# Altium schematic sheet Payload.SchDoc
size A4
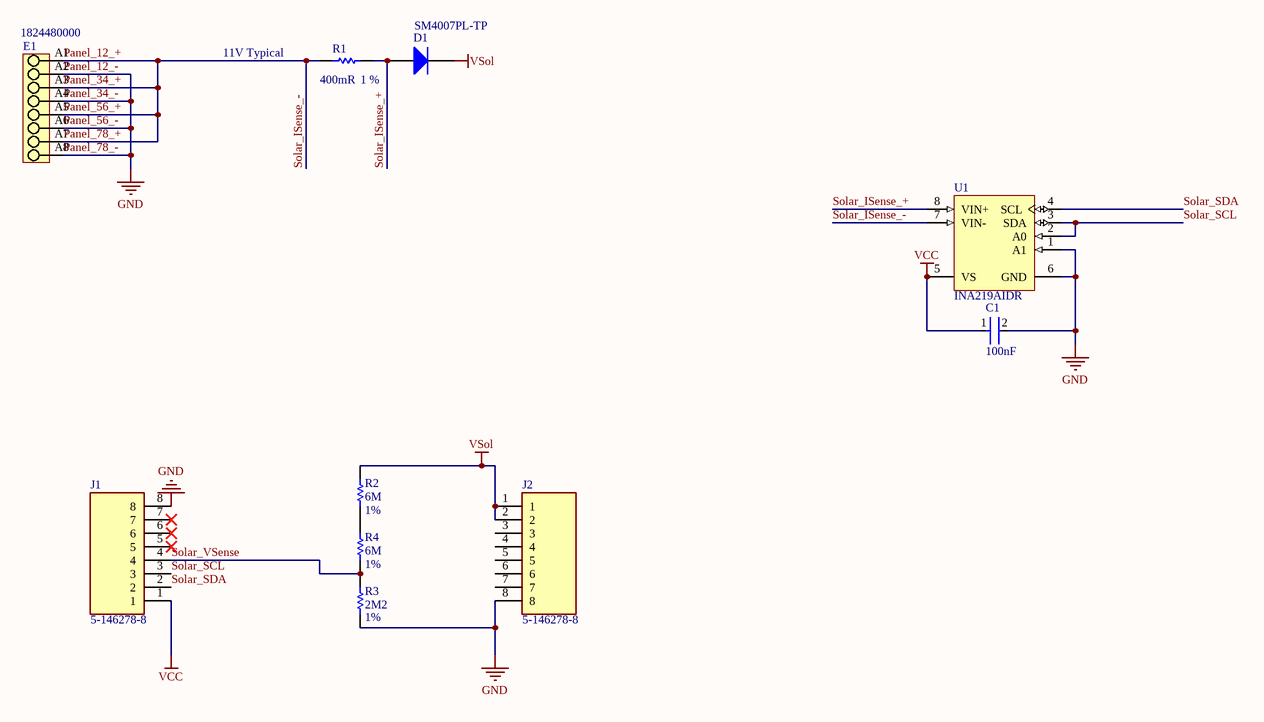
[diagram p0: Payload.SchDoc]

## Parts
C1  value 100nF  [FP-0603-L_1_6_0_15-W_0_81-IPC_C]  (hidden comment: Generic-Capacitor)
D1  SM4007PL-TP  [MCC-SOD-123FL_V]
E1  1824480000  [LSF_SMT_3_5_90_08]
J1  5-146278-8  [HDRV8W56P0X254_1X8_1991X234X872P]
J2  5-146278-8  [HDRV8W56P0X254_1X8_1991X234X872P]
R1  value 400mR  Tolerance: 1 %  [RESC2512(6432)_N]  (hidden comment: Generic Resistor)
R2  value 6M  Tolerance: 1%  [RESC1609X50X30ML8T20]  (hidden comment: Generic-Resistor)
R3  value 2M2  Tolerance: 1%  [RESC1609X50X30ML8T20]  (hidden comment: Generic-Resistor)
R4  value 6M  Tolerance: 1%  [RESC1609X50X30ML8T20]  (hidden comment: Generic-Resistor)
U1  INA219AIDR  [D0008A_L]

## Nets
Panel_12_-: C1.2 E1.A2 E1.A4 E1.A6 E1.A8 J1.8 J2.8 R3.1 U1.1(A1) U1.6(GND)  [also labelled GND, Panel_34_-, Panel_56_-, Panel_78_-]
VCC: C1.1 J1.1 U1.5(VS)
VSol: D1.2(K) J2.1 J2.2 R2.2
Panel_12_+: E1.A1 E1.A3 E1.A5 E1.A7 R1.1 U1.7(VIN-)  [also labelled Panel_34_+, Panel_56_+, Panel_78_+, Solar_ISense_-]
Solar_ISense_+: D1.1(A) R1.2 U1.8(VIN+)
Solar_SCL: J1.3 U1.2(A0) U1.3(SDA)
Solar_SDA: J1.2 U1.4(SCL)
Solar_VSense: J1.4 R3.2 R4.1
NetR2_1: R2.1 R4.2

Not connected (* = marked no-connect by the designer): J1 5* 6* 7*; J2 3 4 5 6 7

## Notes on the sheet
- (near R1) 11V Typical

## Library data of the parts
C1 = CMP-001-00088-6: Generic 0603 Capacitor; Dielectric: X7R; Voltage Rating: 50V; Tolerance: 10%; ESR: 0R; LCSC Part #: C14663; Case Code (Imperial): 0603
D1 = CMP-004-00034-1: DIODE GEN PURP 1KV 1A SOD123FL; LCSC Part #: C64898
E1 = CMP-002-00084-1: Weidmüller OMNIMATE Signal - series LSF LSF-SMT 3.50/08/90 3.5SN BK TU - 1824480000
J1 J2 = CMP-077-000000-1: 08 MODII HDR SRST B/A .100CL; Manufacturer_Name: TE Connectivity; Geometry.Height: 8.72mm; Source: 5-146278-8.SchLib; Datasheet Link: https://componentsearchengine.com/Datasheets/1/5-146278-8.pdf; Design Item ID: 5-146278-8; Mouser Price/Stock: https://www.mouser.com/Search/Refine.aspx?Keyword=571-5-146278-8; Mouser Part Number: 571-5-146278-8; Manufacturer_Part_Number: 5-146278-8
R1 = CMP-1018-00507-1: 931R 1W 1% 2512 (6432 Metric)  SMD; Case-Metric: 6432; Case-EIA: 2512; Technology: SMT; Power: 1 W
R2-R4 = CMP-009-00185-4: Generic 0603 Resistor; Power Rating: 100mW; Voltage Rating: 75V; Case Code (Metric): 1608; Case Code (Imperial): 0603
  R2 R4: LCSC Part #: C322196
  R3: LCSC Part #: C322103
U1 = CMP-010-00030-1: Current Monitor Regulator High-Side 10mA 8-SOIC; LCSC Part #: C138706